# Altium schematic sheet MCU.SchDoc: Наименование
size 209 x 297 mm; ApprovedBy: Утвердил; CheckedBy: Проверил; Author: Разработал; CompanyName: Организация; DrawnBy: Н.Контр; Engineer: Т.Контр; SheetNumber: 3; SheetTotal: 6; PageSetup: Record=PageOptions|CenterHorizontal=True|CenterVertical=True|PrintScale=0.94|XCorrection=1.00|YCorrection=1.00|PrintKind=1|BorderSize=5000000|LeftOffset=0|BottomOffset=0|Orientation=1|PaperLength=1000|PaperWidth=1000|Scale=100|PaperSource=7|PrintQuality=-4|MediaType=1|DitherType=10|PaperKind=A4|PrintScaleMode=1; DecimalNumber: Децимальный номер; HeadOfSector: Нач. сектора; MainDevice: Перв.примен.; Name: Наименование; DocumentName: Sheet1.SCHDOC
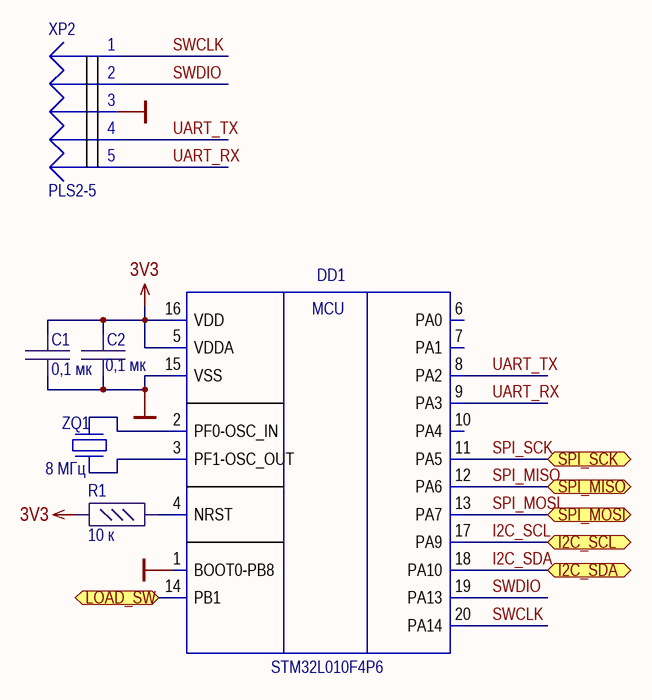
[diagram p0: MCU.SchDoc]

## Parts
C1  0,1 мк  [C_0603]
C2  0,1 мк  [C_0603]
DD1  STM32L010F4P6  [TSSOP-20]
R1  10 к  [R_0603]
XP2  PLS2-5  [PLS2-5]
ZQ1  8 МГц  [MJ CRYSTAL]

## Ports
I2C_SCL (bidir), I2C_SDA (bidir), LOAD_SW (bidir), SPI_MISO (bidir), SPI_MOSI (bidir), SPI_SCK (bidir)

## Nets
3V3: C1.2 C2.2 DD1.5(VDDA) DD1.16(VDD) R1.1
GND: C1.1 C2.1 DD1.1(BOOT0-PB8) DD1.15(VSS) XP2.3
I2C_SCL: DD1.17(PA9) ; port I2C_SCL
I2C_SDA: DD1.18(PA10) ; port I2C_SDA
LOAD_SW: DD1.14(PB1) ; port LOAD_SW
SPI_MISO: DD1.12(PA6) ; port SPI_MISO
SPI_MOSI: DD1.13(PA7) ; port SPI_MOSI
SPI_SCK: DD1.11(PA5) ; port SPI_SCK
SWCLK: DD1.20(PA14) XP2.1
SWDIO: DD1.19(PA13) XP2.2
UART_RX: DD1.9(PA3) XP2.5
UART_TX: DD1.8(PA2) XP2.4
NetDD1_2: DD1.2(PF0-OSC_IN) ZQ1.3
NetDD1_3: DD1.3(PF1-OSC_OUT) ZQ1.1
NetDD1_4: DD1.4(NRST) R1.2

Not connected (* = marked no-connect by the designer): DD1 6(PA0) 7(PA1) 10(PA4)

## Notes on the sheet
- Подп. и дата
- Инв.№ дубл.
- Взам.инв.№
- Подп.и дата
- Инв.№ подл.
- Изм.
- Лист
- № докум.
- Подп.
- Дата
- Формат  A4
- (in symbol STM32L010F4P6) MCU

## Library data of the parts
C1 C2 = GRM188R72A104MA35D: CAP CER 0.1UF 100V X7R 0603; Manufacturer: Murata Electronics; Value: 0.1µF; Part Number: GRM188R72A104MA35D; ComponentLink1URL: https://search.murata.co.jp/Ceramy/image/img/A01X/G101/ENG/GRM188R72A104MA35-01.pdf; ComponentLink1Description: Datasheet; Component Type: Capasitor
R1 = CR0603-FX-1002ELF: RES SMD 10K OHM 1% 1/10W 0603; Manufacturer: Bourns Inc.; Part Number: CR0603-FX-1002ELF; Value: 10 к; ComponentLink1URL: https://www.bourns.com/pdfs/chpreztr.pdf; ComponentLink1Description: Datasheet; Component Type: Resistor
ZQ1 = NX5032GA-8MHz